# Altium schematic sheet INOUT.SchDoc
size A
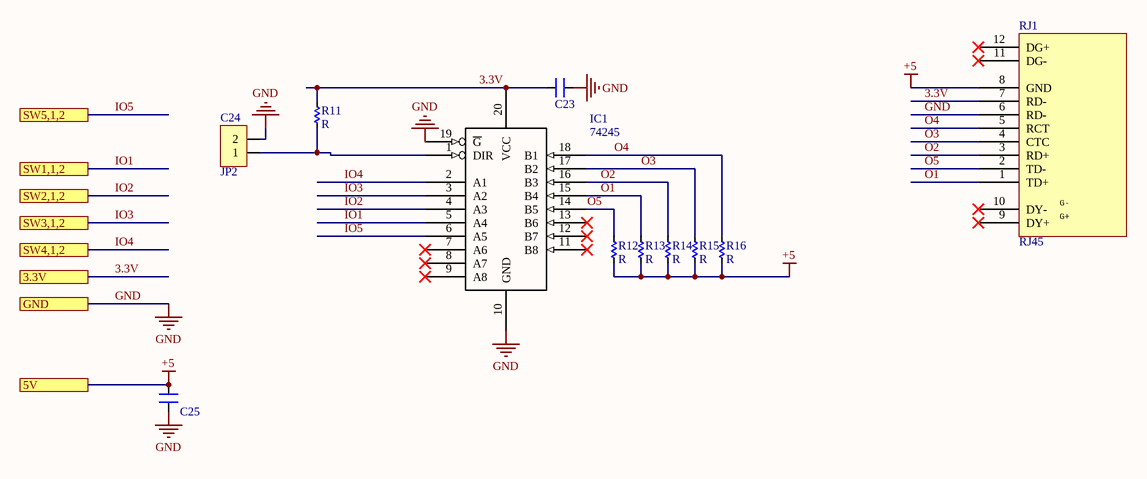
[diagram p0: INOUT.SchDoc]

## Parts
C23  CN  [CN-SMD-0603_big]  (value not drawn)
C24  JP2  [JP2-CLOSED]
C25  CN  [CN-SMD-0603_big]  (value not drawn)
IC1  74245  [SO20]
R11  R  [RES-SMD-0603_BIG]
R12  R  [RES-SMD-0603_BIG]
R13  R  [RES-SMD-0603_BIG]
R14  R  [RES-SMD-0603_BIG]
R15  R  [RES-SMD-0603_BIG]
R16  R  [RES-SMD-0603_BIG]
RJ1  RJ45  [RJ45-Dung]

## Ports
3.3V, 5V, GND, SW1,1,2, SW2,1,2, SW3,1,2, SW4,1,2, SW5,1,2

## Nets
+5: C25.2 R12.2 R13.2 R14.2 R15.2 R16.2 RJ1.8(GND) ; port 5V
GND: C23.2 C24.2 C25.1 IC1.10(GND) IC1.19(~{G}) RJ1.6(RD-) ; port GND
3.3V: C23.1 IC1.20(VCC) R11.1 RJ1.7(RD-) ; port 3.3V
IO1: IC1.5(A4) ; port SW1,1,2
IO2: IC1.4(A3) ; port SW2,1,2
IO3: IC1.3(A2) ; port SW3,1,2
IO4: IC1.2(A1) ; port SW4,1,2
IO5: IC1.6(A5) ; port SW5,1,2
O1: IC1.15(B4) R13.1 RJ1.1(TD+)
O2: IC1.16(B3) R14.1 RJ1.3(RD+)
O3: IC1.17(B2) R15.1 RJ1.4(CTC)
O4: IC1.18(B1) R16.1 RJ1.5(RCT)
O5: IC1.14(B5) R12.1 RJ1.2(TD-)
NetC24_1: C24.1 IC1.1(DIR) R11.2

Not connected (* = marked no-connect by the designer): IC1 7(A6)* 8(A7)* 9(A8)* 11(B8)* 12(B7)* 13(B6)*; RJ1 9(DY+)* 10(DY-)* 11(DG-)* 12(DG+)*

## Notes on the sheet
- (in symbol CON JR45) G-; G+

## Library data of the parts
C23 C25 = CN: Value: 33pF
C24 = JP2: WR-PHD 2.54 mm Angled Socket Header; Manufacturer: W¨¹rth Elektronik eiSos GmbH; partNo: 613002143121; ComponentLink1 Description: Manufacturer; ComponentLink2 Description: Datasheet; NoPins: 02; Created Date: 29 March 2013; ComponentLink1URL: http://www.we-online.com; ComponentLink2URL: http://katalog.we-online.de/em/datasheet/6130xx143121.pdf; Created by: Karrer Zheng
IC1 = 74245: Octal bus tranceiver; 3-state; Copyright by: VanDungEvn@gmail.com
RJ1 = CON JR45: ComponentLink1Description: Mua; ComponentLink1URL: https://thegioiic.com/products/rj45-top-cong-rj45-top-180-do